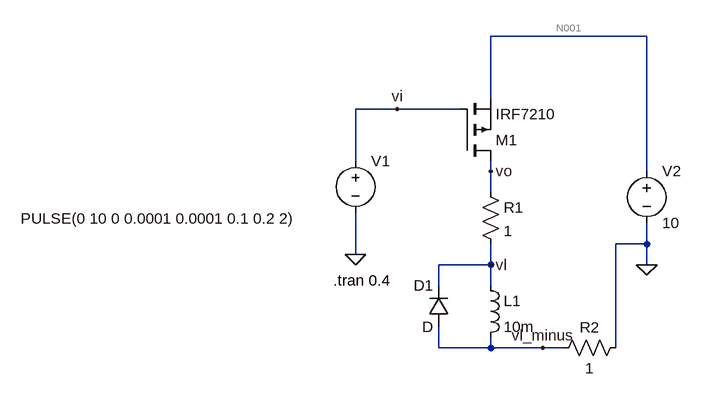
[diagram p0: schematic Draft1.asc]
Draft1.asc, the LTspice schematic file:
Version 4
SHEET 1 880 680
WIRE 416 -96 176 -96
WIRE 176 0 176 -96
WIRE 32 16 -32 16
WIRE 128 16 32 16
WIRE -32 96 -32 16
WIRE 176 112 176 96
WIRE 416 112 416 -96
WIRE 176 144 176 112
WIRE 416 224 416 192
WIRE 416 224 368 224
WIRE -32 240 -32 176
WIRE 176 256 176 224
WIRE 176 256 96 256
WIRE 416 256 416 224
WIRE 96 288 96 256
WIRE 176 288 176 256
WIRE 96 384 96 352
WIRE 176 384 176 368
WIRE 176 384 96 384
WIRE 256 384 176 384
WIRE 288 384 256 384
WIRE 368 384 368 224
FLAG -32 240 0
FLAG 416 256 0
FLAG 32 16 vi
FLAG 176 112 vo
FLAG 176 256 vl
FLAG 256 384 vl_minus
SYMBOL res 160 128 R0
SYMATTR InstName R1
SYMATTR Value 1
SYMBOL voltage -32 80 R0
WINDOW 3 -515 105 Left 2
WINDOW 123 0 0 Left 0
WINDOW 39 0 0 Left 0
SYMATTR InstName V1
SYMATTR Value PULSE(0 10 0 0.0001 0.0001 0.1 0.2 2)
SYMBOL voltage 416 96 R0
WINDOW 123 0 0 Left 0
WINDOW 39 0 0 Left 0
SYMATTR InstName V2
SYMATTR Value 10
SYMBOL pmos 128 96 M180
SYMATTR InstName M1
SYMATTR Value IRF7210
SYMBOL ind 160 272 R0
SYMATTR InstName L1
SYMATTR Value 10m
SYMBOL diode 112 352 R180
WINDOW 0 24 64 Left 2
WINDOW 3 24 0 Left 2
SYMATTR InstName D1
SYMBOL res 384 368 R90
WINDOW 0 0 56 VBottom 2
WINDOW 3 32 56 VTop 2
SYMATTR InstName R2
SYMATTR Value 1
TEXT -66 280 Left 2 !.tran 0.4

The netlist it stands for:
* Draft1.asc
R1 vo vl 1
V1 vi 0 PULSE(0 10 0 0.0001 0.0001 0.1 0.2 2)
V2 N001 0 10
M1 vo vi N001 N001 IRF7210
L1 vl vl_minus 10m
D1 vl_minus vl D
R2 0 vl_minus 1
.model D D
.lib standard.dio
.model NMOS NMOS
.model PMOS PMOS
.lib standard.mos
.tran 0.4
.backanno
.end

* Results of the author's LTspice run, read from the files saved beside the schematic
* Operating Point, zero values left out:
*   V(vo) = 9.977 V
*   V(vl) = 4.991 V
*   V(n001) = 10 V
*   V(vl_minus) = 4.986 V
*   Id(M1) = -4.986 A
*   Is(M1) = 4.986 A
*   I(L1) = 4.986 A
*   I(R2) = -4.986 A
*   I(R1) = 4.986 A
*   I(V2) = -4.986 A
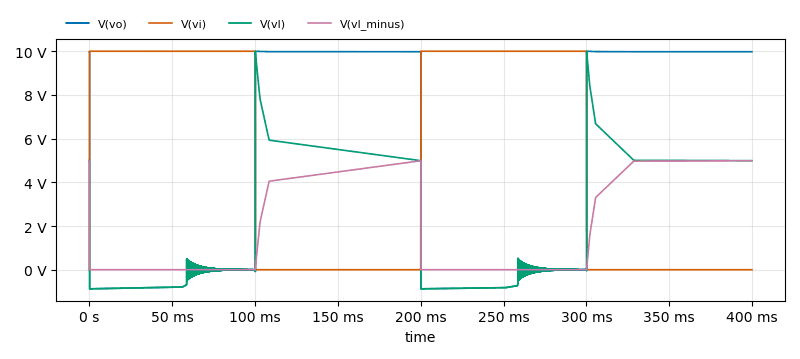
[diagram p1: Transient Analysis of Draft1.asc, plotted from the saved traces]
* Transient Analysis, 1 run:
*   V(vo): min -875.9 mV, max 10 V, average 4.74 V, rms 7.07 V, last 9.977 V
*   V(vi): min 0 V, max 10 V, average 5.005 V, rms 7.074 V, last 0 V
*   V(vl): min -875.6 mV, max 9.999 V, average 2.375 V, rms 3.776 V, last 4.991 V
*   V(vl_minus): min -299.7 µV, max 4.988 V, average 2.365 V, rms 3.387 V, last 4.986 V